# Altium schematic sheet Sheet2.SchDoc
size A4
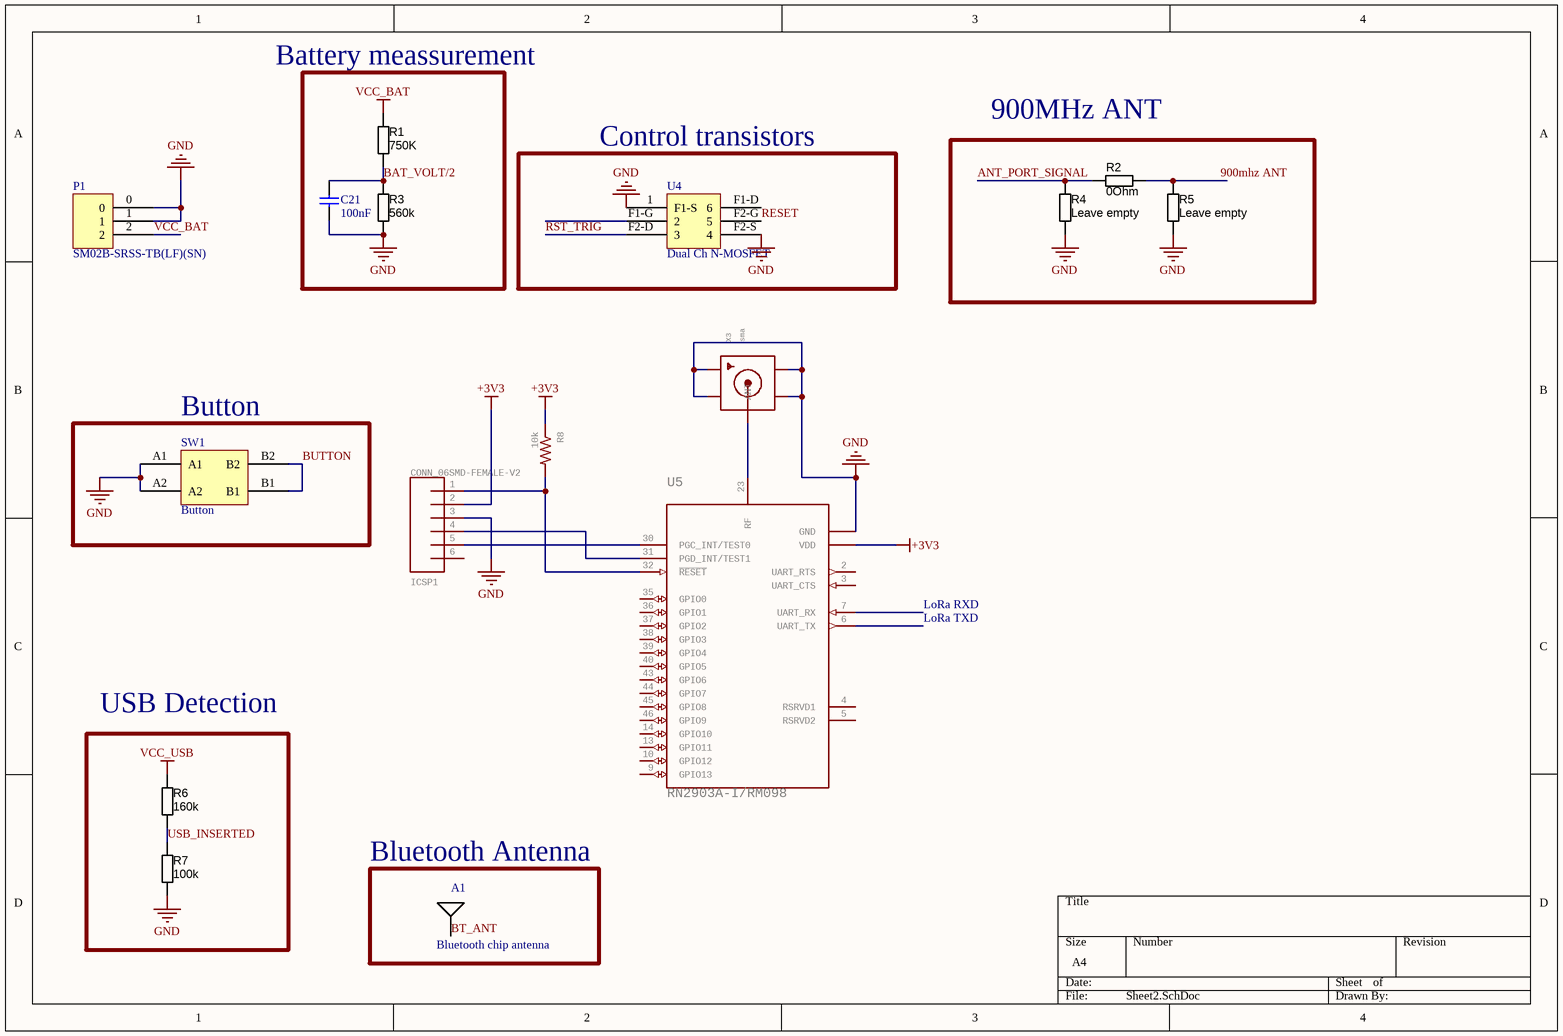
[diagram p0: Sheet2.SchDoc]

## Parts
A1  Bluetooth chip antenna  [2450AT18A100E]
C21  100nF  [CAPC1005X04L]
ICSP1  CONN_06SMD-FEMALE-V2  [1X06-SMD-FEMALE]
P1  SM02B-SRSS-TB(LF)(SN)  [BM02B-SRSS-TB]
R1  value 750K  [RESC1005N]  (hidden comment: 750K 1%)
R2  0Ohm  [RESC1005N]
R3  value 560k  [RESC1005N]  (hidden comment: 560K 1%)
R4  value Leave empty  [RESC1005N]  (hidden comment: not mounted)
R5  value Leave empty  [RESC1005N]  (hidden comment: not mounted)
R6  160k  [RESC1005N]
R7  100k  [RESC1005N]
R8  10k  [R0603]
SW1  Button  [EVQ-Q2K02W]
U4  Dual Ch N-MOSFET  [FC6946010R]
U5  RN2903A-I/RM098  [XCVR_RN2903A-I/RM098]
X3  sma  [SMA_EDGELAUNCH]

## Blocks framed on the sheet
Control transistors: U4
900MHz ANT: R2 R4 R5
Button: SW1
USB Detection: R6 R7
Bluetooth Antenna: A1

## Nets
+3V3: ICSP1.2 R8.1 U5.12_34(VDD)
GND: C21.2 ICSP1.3 P1.0 P1.1 R3.1 R4.1 R5.1 R7.1 SW1.A1 SW1.A2 U4.1(F1-S) U4.F2-S(4) U5.1_8_11_20_21_22_24_26_27_28_33_41_47(GND) X3.GND@1(GND4) X3.GND@2(GND3) X3.GND@3(GND2) X3.GND@4(GND1)
VCC_BAT: P1.2 R1.2
VCC_USB: R6.2
900mhz ANT: R2.2 R5.2
ANT_PORT_SIGNAL: R2.1 R4.2
BAT_VOLT/2: C21.1 R1.1 R3.2
BT_ANT: A1.Feed
BUTTON: SW1.B1 SW1.B2
RESET: U4.F2-G(5)
RST_TRIG: U4.F2-D(3)
USB_INSERTED: R6.1 R7.2
NetICSP1_1: ICSP1.1 R8.2 U5.32(~{RESET})
NetICSP1_4: ICSP1.4 U5.31(PGD_INT/TEST1)
NetICSP1_5: ICSP1.5 U5.30(PGC_INT/TEST0)
NetU5_23: U5.23(RF) X3.P(ANT)

Not connected (* = marked no-connect by the designer): ICSP1 6; U4 F1-D(6) F1-G(2); U5 2(UART_RTS) 3(UART_CTS) 4(RSRVD1) 5(RSRVD2) 6(UART_TX) 7(UART_RX) 9(GPIO13) 10(GPIO12) 13(GPIO11) 14(GPIO10) 35(GPIO0) 36(GPIO1) 37(GPIO2) 38(GPIO3) 39(GPIO4) 40(GPIO5) 43(GPIO6) 44(GPIO7) 45(GPIO8) 46(GPIO9)

## Notes on the sheet
- Battery meassurement
- LoRa RXD
- LoRa TXD

## Library data of the parts
A1 = 2450AT18A100E: Antenna (2450AT18A100E)
C21 = C0402-100n: Generic 10%, X7R, 0402, Capacitor; Note: 16V; Artikkelnr Noca: 20039200; Artikkelnr Simpro: N.A.; Part Number: C0402-100n; Manufacturer: *; Manufacturer Part Number: *; Datasheet: *; LatestRevisionDate: 2009-11-23; Pin Count: 2; Publisher: Nordic Semiconductor; Published: 2009-05-08; Value: 100nF; Supplier: *; Supplier part number: *; 2nd source Supplier: *; 2nd source part number: *; Footprint Doc: 0402
ICSP1 = CONN_06SMD-FEMALE-V2: Multi connection point. Often used as Generic Header-pin footprint for 0.1 inch spaced/style header connections    On any of the 0.1 inch spaced packages, you can populate with these:  Break Away Headers - Straight (PRT-00116)   Break Away Male Headers - Right Angle (PRT-00553)   Female Headers (PRT-00115)   Break Away Headers - Machine Pin (PRT-00117)   Break Away Female Headers - Swiss Machine Pin (PRT-00743)   Arduino Stackable Header - 6 Pin (PRT-09280)        For SCREWTERMINALS and SPRING TERMINALS visit here:  Screw Terimnals on SparkFun.com (5mm/3.5mm/2.54mm spacing)       This device is also useful as a general connection point to wire up your design to another part of your project. Our various solder wires solder well into these plated through hole pads.  Hook-Up Wire - Assortment (Stranded, 22 AWG) (PRT-11375)   Hook-Up Wire - Assortment (Solid Core, 22 AWG) (PRT-11367)   View the entire wire category on our website here; GateName_1: G$1; PROD_ID: CONN-09668; SymbolName_1: CONN_06; DeviceName: SMD-FEMALE-V2; LibraryName: SparkFun-Connectors; DeviceSetName: CONN_06
R1 R3 = RES_2K2_0402_5%: Generic 1% 0402 resistor; Manufacturer 1: Vishay Dale; Manufacturer Part Number 1: CRCW04022K20JNED; Ratings: 1/16 W; Tolerance: ±5%; Package / Case: 0402 (1005 metric); Material: Thick Film; Manufacturer 2: Yageo; Manufacturer Part Number 2: RC0402JR-072K2L; Supplier 1: Digi-Key; Supplier Part Number 1: 541-2.2KJCT-ND; ComponentLink1URL: http://www.vishay.com/doc?20035; ComponentLink1Description: http://www.vishay.com/doc?20035; Supplier 2: Digi-Key; Supplier Part Number 2: 311-2.2KJRCT-ND; ComponentLink2URL: http://www.yageo.com/documents/recent/PYu-RC0402_51_RoHS_L_6.pdf; ComponentLink2Description: http://www.yageo.com/documents/recent/PYu-RC0402_51_RoHS_L_6.pdf
R2 = RES_2K2_0402_5%: Resistor SMD  0402; Manufacturer 1: Vishay Dale; Manufacturer Part Number 1: CRCW04022K20JNED; Ratings: 1/16 W; Tolerance: ±5%; Package / Case: 0402 (1005 metric); Material: Thick Film; Manufacturer 2: Yageo; Manufacturer Part Number 2: RC0402JR-072K2L; Supplier 1: Digi-Key; Supplier Part Number 1: 541-2.2KJCT-ND; ComponentLink1URL: http://www.vishay.com/doc?20035; ComponentLink1Description: http://www.vishay.com/doc?20035; Supplier 2: Digi-Key; Supplier Part Number 2: 311-2.2KJRCT-ND; ComponentLink2URL: http://www.yageo.com/documents/recent/PYu-RC0402_51_RoHS_L_6.pdf; ComponentLink2Description: http://www.yageo.com/documents/recent/PYu-RC0402_51_RoHS_L_6.pdf; Value: 0Ohm
R4 = RES_2K2_0402_5%: Resistor SMD 0402 (not mounted); Manufacturer 1: Vishay Dale; Manufacturer Part Number 1: CRCW04022K20JNED; Ratings: 1/16 W; Tolerance: ±5%; Package / Case: 0402 (1005 metric); Material: Thick Film; Manufacturer 2: Yageo; Manufacturer Part Number 2: RC0402JR-072K2L; Supplier 1: Digi-Key; Supplier Part Number 1: 541-2.2KJCT-ND; ComponentLink1URL: http://www.vishay.com/doc?20035; ComponentLink1Description: http://www.vishay.com/doc?20035; Supplier 2: Digi-Key; Supplier Part Number 2: 311-2.2KJRCT-ND; ComponentLink2URL: http://www.yageo.com/documents/recent/PYu-RC0402_51_RoHS_L_6.pdf; ComponentLink2Description: http://www.yageo.com/documents/recent/PYu-RC0402_51_RoHS_L_6.pdf
R5 = RES_2K2_0402_5%: Resistor SMD  0402 (not mounted); Manufacturer 1: Vishay Dale; Manufacturer Part Number 1: CRCW04022K20JNED; Ratings: 1/16 W; Tolerance: ±5%; Package / Case: 0402 (1005 metric); Material: Thick Film; Manufacturer 2: Yageo; Manufacturer Part Number 2: RC0402JR-072K2L; Supplier 1: Digi-Key; Supplier Part Number 1: 541-2.2KJCT-ND; ComponentLink1URL: http://www.vishay.com/doc?20035; ComponentLink1Description: http://www.vishay.com/doc?20035; Supplier 2: Digi-Key; Supplier Part Number 2: 311-2.2KJRCT-ND; ComponentLink2URL: http://www.yageo.com/documents/recent/PYu-RC0402_51_RoHS_L_6.pdf; ComponentLink2Description: http://www.yageo.com/documents/recent/PYu-RC0402_51_RoHS_L_6.pdf
R6 R7 = RES_2K2_0402_5%: Generic 5% 0402 resistor; Manufacturer 1: Vishay Dale; Manufacturer Part Number 1: CRCW04022K20JNED; Ratings: 1/16 W; Package / Case: 0402 (1005 metric); Tolerance: ±5%; Material: Thick Film; Manufacturer 2: Yageo; Manufacturer Part Number 2: RC0402JR-072K2L; Supplier 1: Digi-Key; Supplier Part Number 1: 541-2.2KJCT-ND; ComponentLink1URL: http://www.vishay.com/doc?20035; ComponentLink1Description: http://www.vishay.com/doc?20035; Supplier 2: Digi-Key; Supplier Part Number 2: 311-2.2KJRCT-ND; ComponentLink2URL: http://www.yageo.com/documents/recent/PYu-RC0402_51_RoHS_L_6.pdf; ComponentLink2Description: http://www.yageo.com/documents/recent/PYu-RC0402_51_RoHS_L_6.pdf
  R6: Value: 160k
  R7: Value: 100k
R8 = R-US_R0603: RESISTOR, American symbol; GateName_1: G$1; SymbolName_1: R-US; DeviceSetName: R-US_; DeviceName: R0603; LibraryName: resistor
SW1 = EVQ-Q2K02W: EVQ-Q2K03W
U4 = FC6946010R
U5 = RN2903A-I/RM098: 300kbps 18.5 dBm LoRa (Low Power Long Range) 915 MHz Transceiver Module; GateName_1: G$1; MF: Microchip; SymbolName_1: RN2903A-I/RM098; LibraryName: bitsetters; DeviceSetName: RN2903A-I/RM098; AVAILABILITY: Bad; MP: RN2903A-I/RM098; PACKAGE: Module Microchip; PRICE: 12.18 USD
X3 = SMACONNECTOR_EDGE: SMA Connector   90Â° DIP SMA Connector, 50 Ohm (4UConnector: 07259); GateName_1: G$1; DeviceName: _EDGE; SymbolName_1: SMACONNECTOR; LibraryName: adafruit; DeviceSetName: SMACONNECTOR